# EAGLE design Rs485hub (EAGLE 6.5.0)
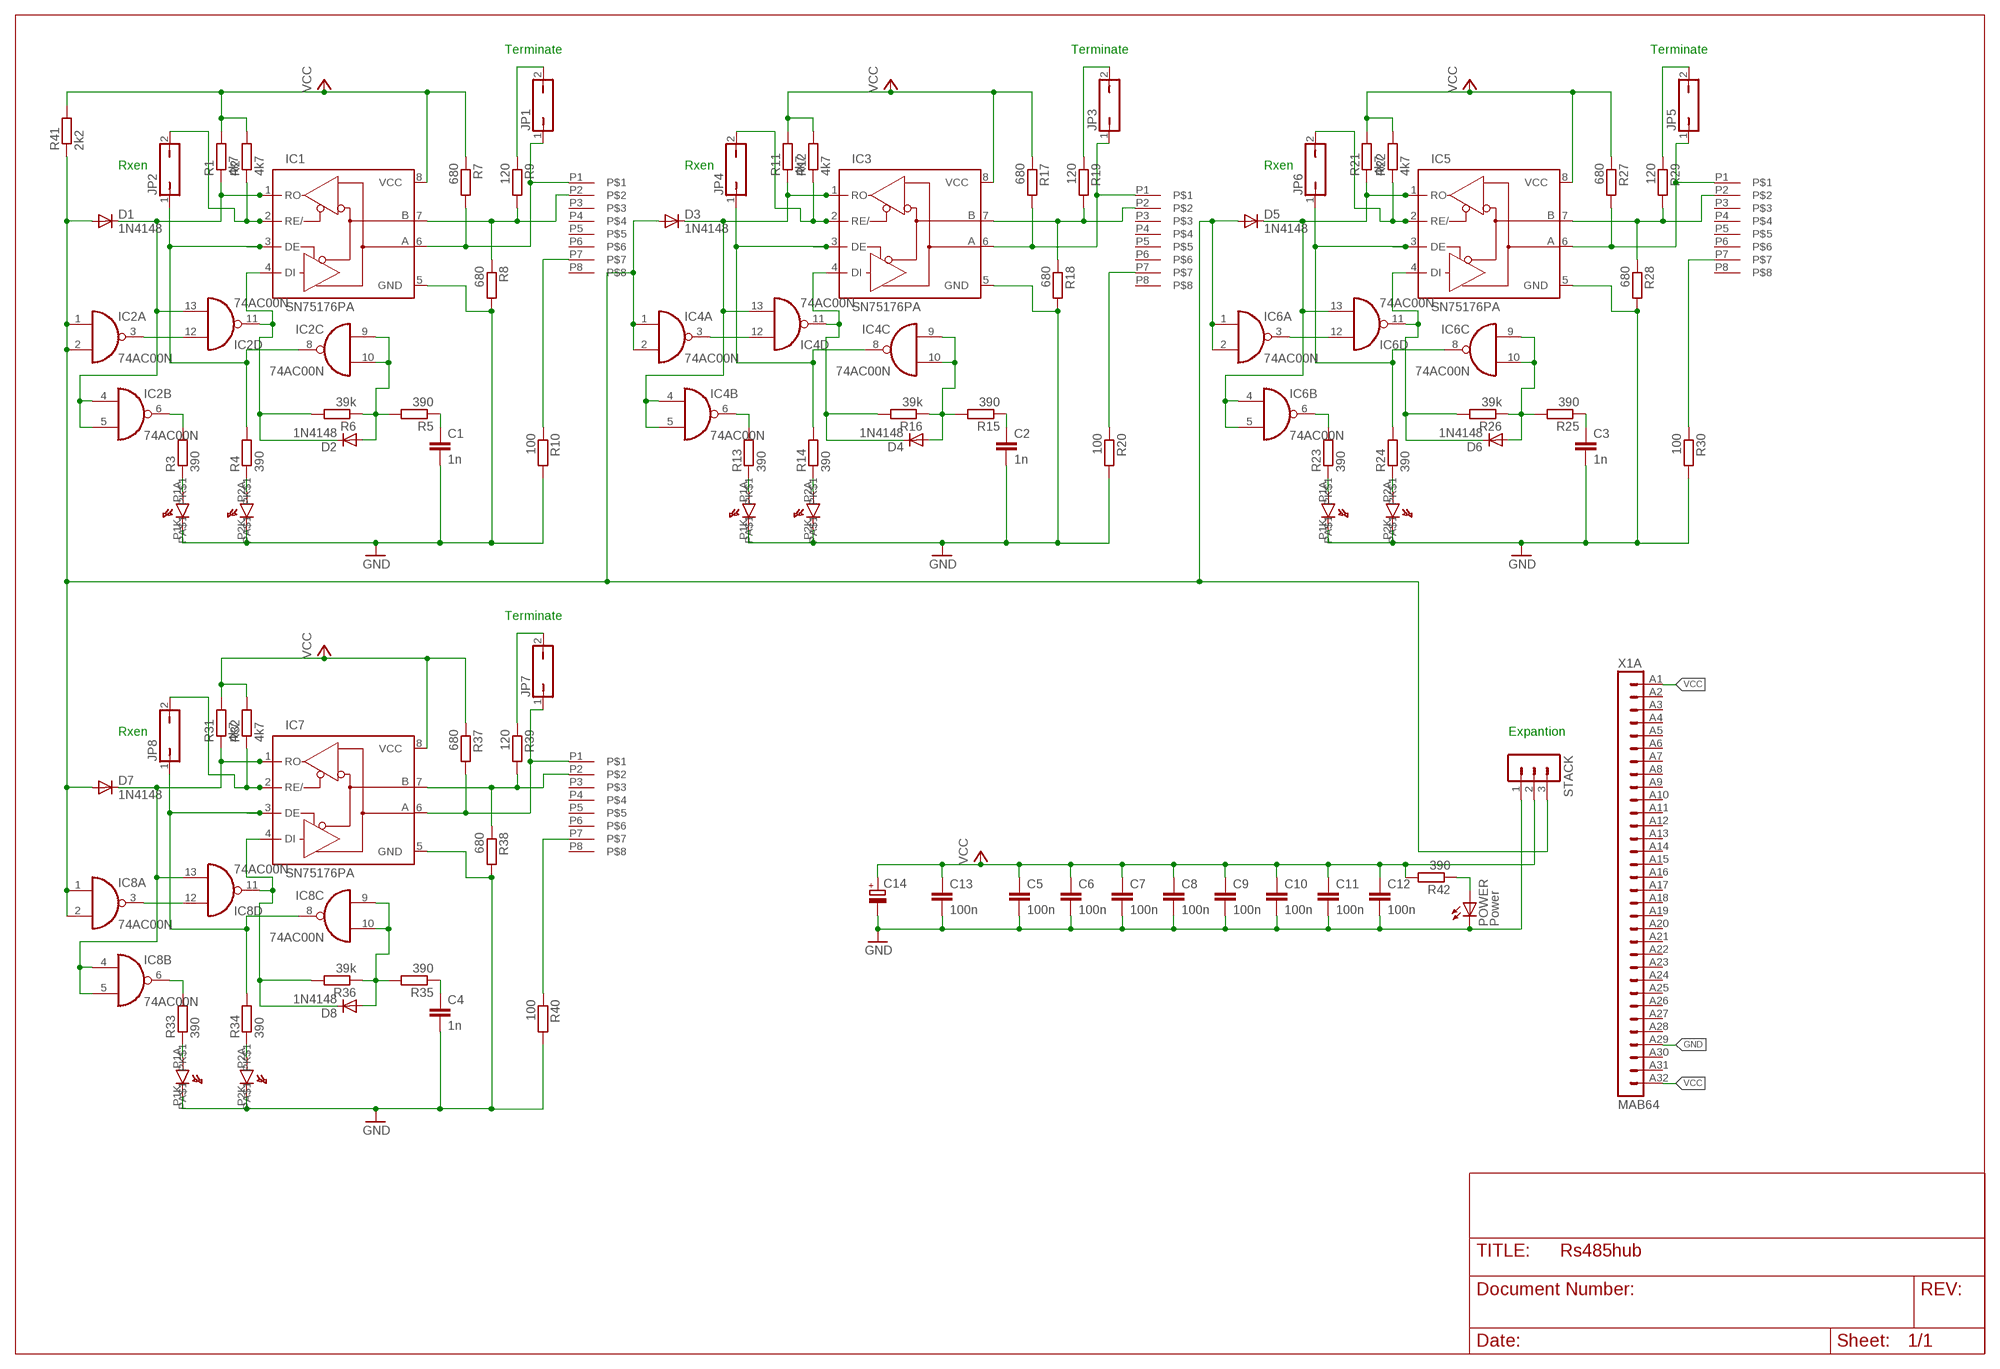
[diagram p0: schematic, sheet 1]

## Parts
C1  1n  C2,5-3  [C2.5-3]
C2  1n  C2,5-3  [C2.5-3]
C3  1n  C2,5-3  [C2.5-3]
C4  1n  C2,5-3  [C2.5-3]
C5  100n  C2,5-3  [C2.5-3]
C6  100n  C2,5-3  [C2.5-3]
C7  100n  C2,5-3  [C2.5-3]
C8  100n  C2,5-3  [C2.5-3]
C9  100n  C2,5-3  [C2.5-3]
C10  100n  C2,5-3  [C2.5-3]
C11  100n  C2,5-3  [C2.5-3]
C12  100n  C2,5-3  [C2.5-3]
C13  100n  C2,5-3  [C2.5-3]
C14  CPOL-EUE5-8.5  [E5-8,5]
D1  1N4148  [DO35-10]
D2  1N4148  [DO35-10]
D3  1N4148  [DO35-10]
D4  1N4148  [DO35-10]
D5  1N4148  [DO35-10]
D6  1N4148  [DO35-10]
D7  1N4148  [DO35-10]
D8  1N4148  [DO35-10]
IC1  SN75176PA  [DIL08]
IC2  74AC00N  [DIL14]
IC3  SN75176PA  [DIL08]
IC4  74AC00N  [DIL14]
IC5  SN75176PA  [DIL08]
IC6  74AC00N  [DIL14]
IC7  SN75176PA  [DIL08]
IC8  74AC00N  [DIL14]
JP1  JP1Q  [JP1]
JP2  JP1Q  [JP1]
JP3  JP1Q  [JP1]
JP4  JP1Q  [JP1]
JP5  JP1Q  [JP1]
JP6  JP1Q  [JP1]
JP7  JP1Q  [JP1]
JP8  JP1Q  [JP1]
POWER  Power  LED3MM  [LED3MM]
R1  4k7  R-EU_0309/10  [0309/10]
R2  4k7  R-EU_0309/10  [0309/10]
R3  390  R-EU_0309/10  [0309/10]
R4  390  R-EU_0309/10  [0309/10]
R5  390  R-EU_0309/10  [0309/10]
R6  39k  R-EU_0309/10  [0309/10]
R7  680  R-EU_0309/10  [0309/10]
R8  680  R-EU_0309/10  [0309/10]
R9  120  R-EU_0309/10  [0309/10]
R10  100  R-EU_0309/10  [0309/10]
R11  4k7  R-EU_0309/10  [0309/10]
R12  4k7  R-EU_0309/10  [0309/10]
R13  390  R-EU_0309/10  [0309/10]
R14  390  R-EU_0309/10  [0309/10]
R15  390  R-EU_0309/10  [0309/10]
R16  39k  R-EU_0309/10  [0309/10]
R17  680  R-EU_0309/10  [0309/10]
R18  680  R-EU_0309/10  [0309/10]
R19  120  R-EU_0309/10  [0309/10]
R20  100  R-EU_0309/10  [0309/10]
R21  4k7  R-EU_0309/10  [0309/10]
R22  4k7  R-EU_0309/10  [0309/10]
R23  390  R-EU_0309/10  [0309/10]
R24  390  R-EU_0309/10  [0309/10]
R25  390  R-EU_0309/10  [0309/10]
R26  39k  R-EU_0309/10  [0309/10]
R27  680  R-EU_0309/10  [0309/10]
R28  680  R-EU_0309/10  [0309/10]
R29  120  R-EU_0309/10  [0309/10]
R30  100  R-EU_0309/10  [0309/10]
R31  4k7  R-EU_0309/10  [0309/10]
R32  4k7  R-EU_0309/10  [0309/10]
R33  390  R-EU_0309/10  [0309/10]
R34  390  R-EU_0309/10  [0309/10]
R35  390  R-EU_0309/10  [0309/10]
R36  39k  R-EU_0309/10  [0309/10]
R37  680  R-EU_0309/10  [0309/10]
R38  680  R-EU_0309/10  [0309/10]
R39  120  R-EU_0309/10  [0309/10]
R40  100  R-EU_0309/10  [0309/10]
R41  2k2  R-EU_0309/10  [0309/10]
R42  390  R-EU_0309/10  [0309/10]
STACK  MA03-1  [MA03-1]
U$2  RJHS508  [P-RJHS-538X]
U$3  RJHS508  [P-RJHS-538X]
U$4  RJHS508  [P-RJHS-538X]
U$5  RJHS508  [P-RJHS-538X]
X1  MAB64  [MAB64]

## Nets
DATABUS: D1.A D3.A D5.A D7.A IC2.1(A:I0) IC2.2(A:I1) IC4.1(A:I0) IC4.2(A:I1) IC6.1(A:I0) IC6.2(A:I1) IC8.1(A:I0) IC8.2(A:I1) R41.1 STACK.3
GND [Gnd]: C1.2 C2.2 C3.2 C4.2 C5.2 C6.2 C7.2 C8.2 C9.2 C10.2 C11.2 C12.2 C13.2 C14.- IC1.5(GND) IC3.5(GND) IC5.5(GND) IC7.5(GND) POWER.K(C) R8.2 R10.2 R18.2 R20.2 R28.2 R30.2 R38.2 R40.2 STACK.1 U$2.P1K(PK$1) U$2.P2K(PK$1) U$3.P1K(PK$1) U$3.P2K(PK$1) U$4.P1K(PK$1) U$4.P2K(PK$1) U$5.P1K(PK$1) U$5.P2K(PK$1) X1.A29
N$1: R4.1 U$2.P2A(PA$1)
N$2: R3.1 U$2.P1A(PA$1)
N$3: R10.1 U$2.P7
N$4: IC1.7(B) R8.1 R9.2 U$2.P2
N$5: JP1.2 R9.1
N$6: R14.1 U$3.P2A(PA$1)
N$8: D1.C IC1.1(RO) IC2.4(B:I0) IC2.5(B:I1) IC2.13(D:I1) R1.1
N$9: IC2.3(A:O) IC2.12(D:I0)
N$10: IC1.6(A) JP1.1 R7.2 U$2.P1
N$11: IC2.6(B:O) R3.2
N$12: IC1.3(DE) IC2.8(C:O) JP2.1 R4.2
N$13: IC1.2(RE/) JP2.2 R2.1
N$14: D2.A IC2.9(C:I0) IC2.10(C:I1) R5.2 R6.1
N$15: D2.C IC1.4(DI) IC2.11(D:O) R6.2
N$16: C1.1 R5.1
N$17: R13.1 U$3.P1A(PA$1)
N$18: IC3.7(B) R18.1 R19.2 U$3.P2
N$19: JP3.2 R19.1
N$20: IC3.6(A) JP3.1 R17.2 U$3.P1
N$21: IC7.6(A) JP7.1 R37.2 U$5.P1
N$22: D3.C IC3.1(RO) IC4.4(B:I0) IC4.5(B:I1) IC4.13(D:I1) R11.1
N$23: IC4.3(A:O) IC4.12(D:I0)
N$24: IC4.6(B:O) R13.2
N$25: IC3.3(DE) IC4.8(C:O) JP4.1 R14.2
N$26: D4.A IC4.9(C:I0) IC4.10(C:I1) R15.2 R16.1
N$27: D4.C IC3.4(DI) IC4.11(D:O) R16.2
N$28: C2.1 R15.1
N$29: IC3.2(RE/) JP4.2 R12.1
N$30: R20.1 U$3.P7
N$31: R24.1 U$4.P2A(PA$1)
N$32: R23.1 U$4.P1A(PA$1)
N$33: IC5.7(B) R28.1 R29.2 U$4.P2
N$34: JP5.2 R29.1
N$35: IC5.6(A) JP5.1 R27.2 U$4.P1
N$36: POWER.A R42.1
N$37: D5.C IC5.1(RO) IC6.4(B:I0) IC6.5(B:I1) IC6.13(D:I1) R21.1
N$38: IC6.3(A:O) IC6.12(D:I0)
N$39: IC6.6(B:O) R23.2
N$40: IC5.3(DE) IC6.8(C:O) JP6.1 R24.2
N$41: D6.A IC6.9(C:I0) IC6.10(C:I1) R25.2 R26.1
N$42: D6.C IC5.4(DI) IC6.11(D:O) R26.2
N$43: C3.1 R25.1
N$44: IC5.2(RE/) JP6.2 R22.1
N$45: R30.1 U$4.P7
N$46: R34.1 U$5.P2A(PA$1)
N$47: R33.1 U$5.P1A(PA$1)
N$48: IC7.7(B) R38.1 R39.2 U$5.P2
N$49: JP7.2 R39.1
N$52: D7.C IC7.1(RO) IC8.4(B:I0) IC8.5(B:I1) IC8.13(D:I1) R31.1
N$53: IC8.3(A:O) IC8.12(D:I0)
N$54: IC8.6(B:O) R33.2
N$55: IC7.3(DE) IC8.8(C:O) JP8.1 R34.2
N$56: D8.A IC8.9(C:I0) IC8.10(C:I1) R35.2 R36.1
N$57: D8.C IC7.4(DI) IC8.11(D:O) R36.2
N$58: C4.1 R35.1
N$59: IC7.2(RE/) JP8.2 R32.1
N$60: R40.1 U$5.P7
VCC [Vcc]: C5.1 C6.1 C7.1 C8.1 C9.1 C10.1 C11.1 C12.1 C13.1 C14.+ IC1.8(VCC) IC3.8(VCC) IC5.8(VCC) IC7.8(VCC) R1.2 R2.2 R7.1 R11.2 R12.2 R17.1 R21.2 R22.2 R27.1 R31.2 R32.2 R37.1 R41.2 R42.2 STACK.2 X1.A1 X1.A32
Unconnected: U$2.P3 U$2.P4 U$2.P5 U$2.P6 U$2.P8 U$3.P3 U$3.P4 U$3.P5 U$3.P6 U$3.P8 U$4.P3 U$4.P4 U$4.P5 U$4.P6 U$4.P8 U$5.P3 U$5.P4 U$5.P5 U$5.P6 U$5.P8 X1.A2 X1.A3 X1.A4 X1.A5 X1.A6 X1.A7 X1.A8 X1.A9 X1.A10 X1.A11 X1.A12 X1.A13 X1.A14 X1.A15 X1.A16 X1.A17 X1.A18 X1.A19 X1.A20 X1.A21 X1.A22 X1.A23 X1.A24 X1.A25 X1.A26 X1.A27 X1.A28 X1.A30 X1.A31 X1.B1 X1.B2 X1.B3 X1.B4 X1.B5 X1.B6 X1.B7 X1.B8 X1.B9 X1.B10 X1.B11 X1.B12 X1.B13 X1.B14 X1.B15 X1.B16 X1.B17 X1.B18 X1.B19 X1.B20 X1.B21 X1.B22 X1.B23 X1.B24 X1.B25 X1.B26 X1.B27 X1.B28 X1.B29 X1.B30 X1.B31 X1.B32

## Notes on the sheet
- Terminate | Terminate | Terminate
- Rxen | Rxen | Rxen
- Terminate
- Rxen | Expantion

## Power pins joined to a net without a drawn wire
GND: IC2.7(P:GND) IC4.7(P:GND) IC6.7(P:GND) IC8.7(P:GND)
VCC: IC2.14(P:VCC) IC4.14(P:VCC) IC6.14(P:VCC) IC8.14(P:VCC)

## Library data of the parts
C1-C13 = capacitor-wima:C: CAPACITOR naming: grid - package width
C14 = rcl:CPOL-EU: POLARIZED CAPACITOR, European symbol
D1-D8 = diode:1N4148: DIODE high speed (Philips)
IC1 IC3 IC5 IC7 = Evert:SN75176: +5V, Fail-Safe, 40Mbps, Profibus RS-485/RS-422 Transceivers
IC2 IC4 IC6 IC8 = 74xx-eu:74*00: Quad 2-input NAND gate
JP1-JP8 = jumper:JP1Q: JUMPER
POWER = led:LED: LED OSRAM: - CHIPLED LG R971, LG N971, LY N971, LG Q971, LY Q971, LO R971, LY R971 LH N974, LH R974 LS Q976, LO Q976, LY Q976 LO Q996 - Hyper CHIPLED LW Q18S LB Q993, LB Q99A, LB R99A - SideLED LS A670, LO A670, LY A670, LG A670, LP A670 LB A673, LV A673, LT A673, LW A673 LH A674 LY A675 LS A676, LA A676, LO A676, LY A676, LW A676 LS A679, LY A679, LG A679 - Hyper Micro SIDELED® LS Y876, LA Y876, LO Y876, LY Y876 LT Y87S - SmartLED LW L88C, LW L88S LB L89C, LB L89S, LG L890 LS L89K, LO L89K, LY L89K LS L896, LA L896, LO L896, LY L896 - TOPLED LS T670, LO T670, LY T670, LG T670, LP T670 LSG T670, LSP T670, LSY T670, LOP T670, LYG T670 LG T671, LOG T671, LSG T671 LB T673, LV T673, LT T673, LW T673 LH T674 LS T676, LA T676, LO T676, LY T676, LB T676, LH T676, LSB T676, LW T676 LB T67C, LV T67C, LT T67C, LS T67K, LO T67K, LY T67K, LW E67C LS E67B, LA E67B, LO E67B, LY E67B, LB E67C, LV E67C, LT E67C LW T67C LS T679, LY T679, LG T679 LS T770, LO T770, LY T770, LG T770, LP T770 LB T773, LV T773, LT T773, LW T773 LH T774 LS E675, LA E675, LY E675, LS T675 LS T776, LA T776, LO T776, LY T776, LB T776 LHGB T686 LT T68C, LB T68C - Hyper Mini TOPLED® LB M676 - Mini TOPLED Santana® LG M470 LS M47K, LO M47K, LY M47K Source: http://www.osram.convergy.de LUXEON: - LUMILED® LXK2-PW12-R00, LXK2-PW12-S00, LXK2-PW14-U00, LXK2-PW14-V00 LXK2-PM12-R00, LXK2-PM12-S00, LXK2-PM14-U00 LXK2-PE12-Q00, LXK2-PE12-R00, LXK2-PE12-S00, LXK2-PE14-T00, LXK2-PE14-U00 LXK2-PB12-K00, LXK2-PB12-L00, LXK2-PB12-M00, LXK2-PB14-N00, LXK2-PB14-P00, LXK2-PB14-Q00 LXK2-PR12-L00, LXK2-PR12-M00, LXK2-PR14-Q00, LXK2-PR14-R00 LXK2-PD12-Q00, LXK2-PD12-R00, LXK2-PD12-S00 LXK2-PH12-R00, LXK2-PH12-S00 LXK2-PL12-P00, LXK2-PL12-Q00, LXK2-PL12-R00 Source: www.luxeon.com KINGBRIGHT: KA-3528ASYC Source: www.kingbright.com
R1-R42 = rcl:R-EU_: RESISTOR, European symbol
STACK = con-lstb:MA03-1: PIN HEADER
U$2-U$5 = RJHS:RJHS508
X1 = con-vg:MAB64: CONNECTOR male, 94 pins, type B, rows AB, grid 2.54 mm

## Net classes
0 default: width 0.4 mm, clearance 0.254 mm
1 Vcc: width 1 mm, clearance 0.15 mm
2 Gnd: clearance 0.15 mm

## Board
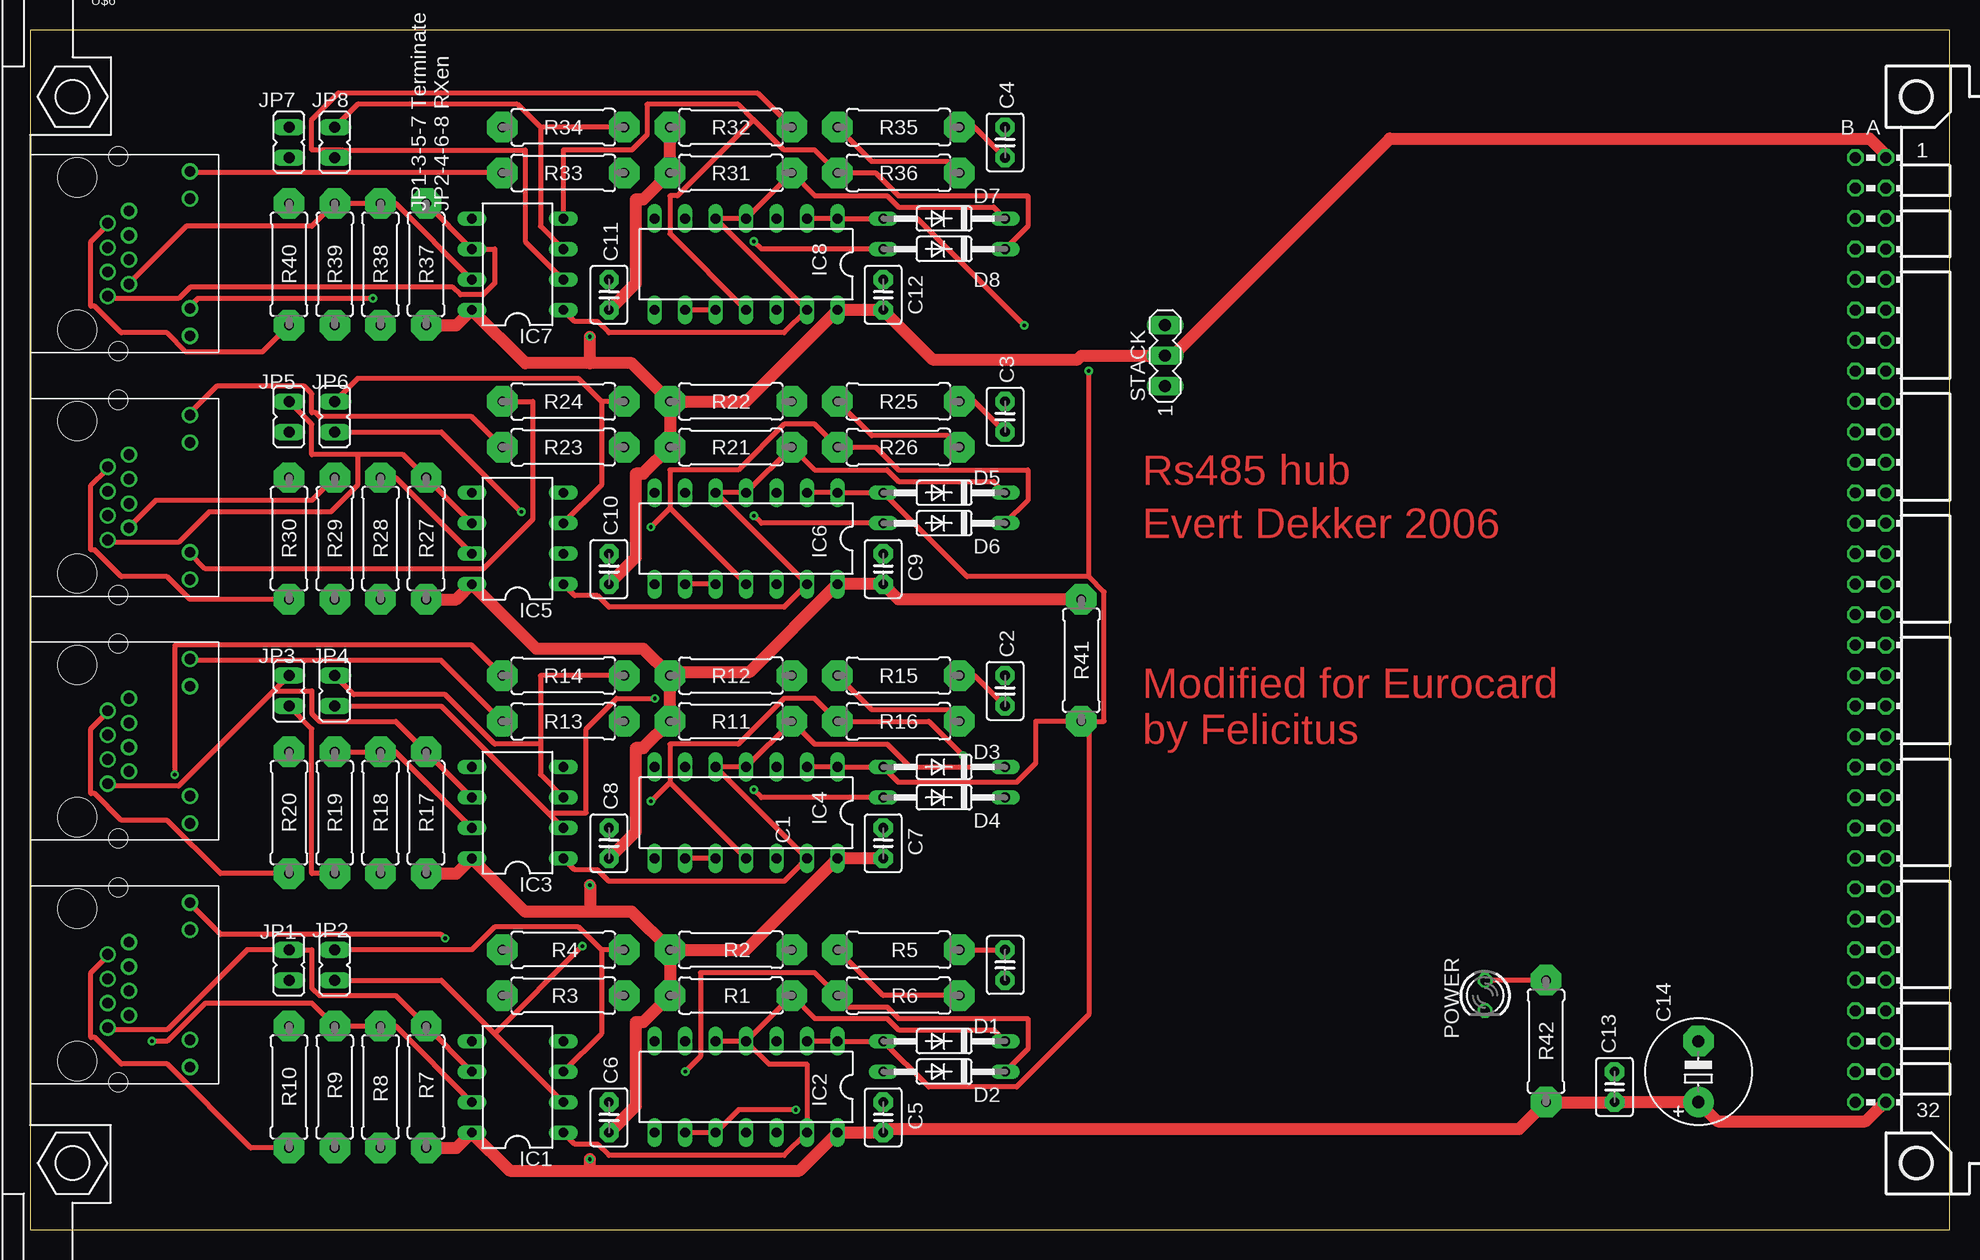
[diagram p1: board, top side]
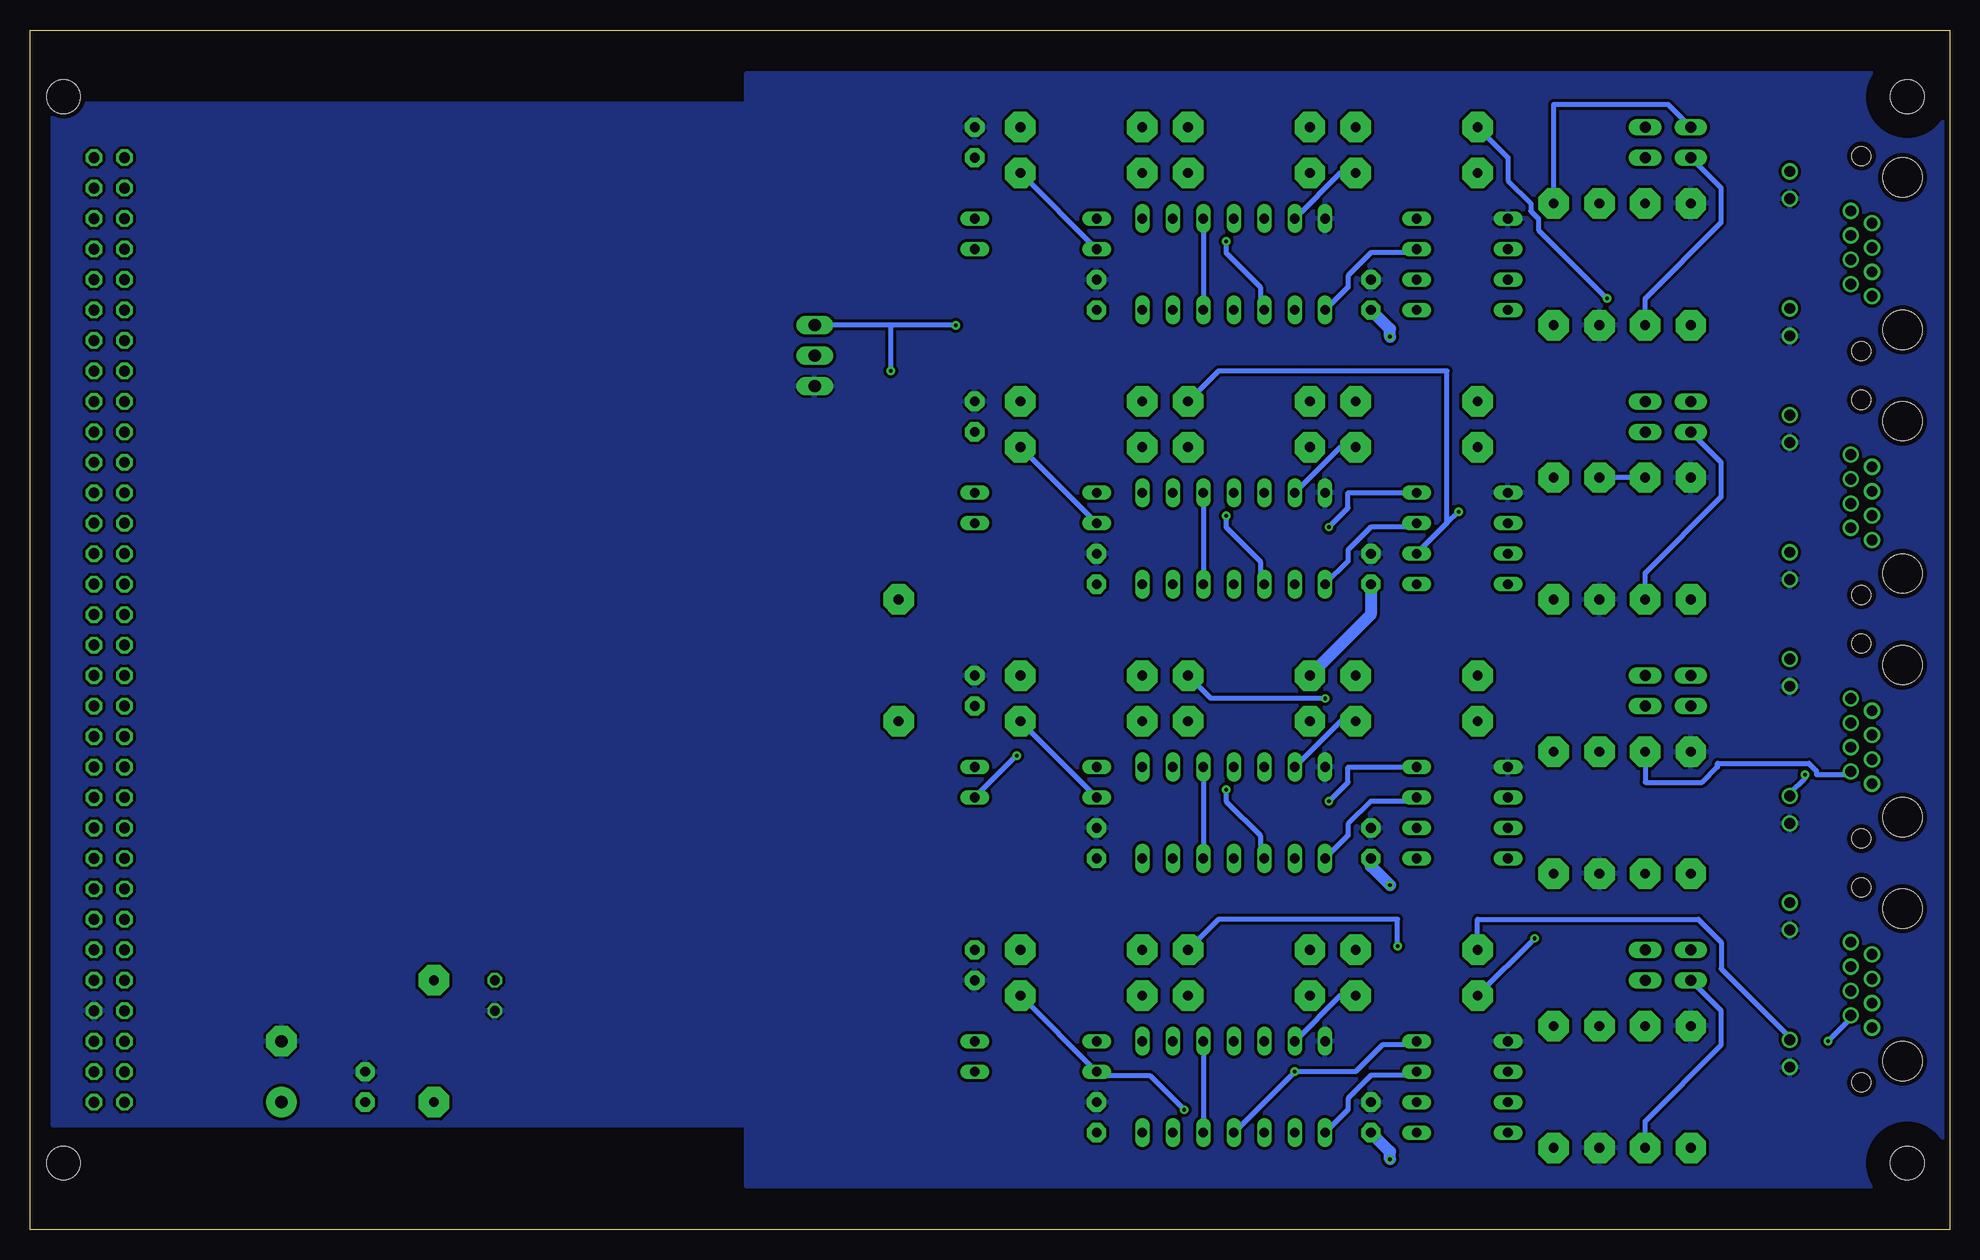
[diagram p2: board, bottom side, seen from below]

Size 160.03 x 100.03 mm. Coordinates in mm from the lower left corner, seen from the top.
Copper layers (1*16): Top 0.035mm / dielectric 1.5mm / Bottom 0.035mm
Design rules "pcb-devboards_35µmCU_200µm_Strukturen_Abstaende": minimum track width 0.2mm, minimum drill 0.3mm, track to track 0.2mm, track to pad 0.2mm, pad to pad 0.2mm, via to via 0.2mm, smd to smd 0.2mm, copper to edge 0.4mm, drill to drill 0.4mm, minimum pad ring 0.2mm, minimum via ring 0.2mm, stop-mask expansion 0.1mm, vias tented up to drill 0mil, thermal gap 0.2mm

### Footprints (pad centres in the part's own frame; a part is rotated, then mirrored left to right if it is on the bottom)
C2.5-3 = drill 0.813 pad 1.6 octagon: 1 -1.27,0; 2 1.27,0
E5-8,5 = drill 1.016 pad 2.54: + -2.54,0 | drill 1.016 pad 2.54 octagon: - 2.54,0
DO35-10 = drill 0.813 long: A 5.08,0; C -5.08,0
DIL08 = drill 0.813 long: 1 -3.81,-3.81; 2 -1.27,-3.81; 3 1.27,-3.81; 4 3.81,-3.81; 5 3.81,3.81; 6 1.27,3.81; 7 -1.27,3.81; 8 -3.81,3.81
DIL14 = drill 0.813 long: 1 -7.62,-3.81; 2 -5.08,-3.81; 3 -2.54,-3.81; 4 0,-3.81; 5 2.54,-3.81; 6 5.08,-3.81; 7 7.62,-3.81; 8 7.62,3.81; 9 5.08,3.81; 10 2.54,3.81; 11 0,3.81; 12 -2.54,3.81; 13 -5.08,3.81; 14 -7.62,3.81
JP1 = drill 0.914 long: 1 0,-1.27; 2 0,1.27
LED3MM = drill 0.813 octagon: A -1.27,0; K 1.27,0
0309/10 = drill 0.813 pad 2.54 octagon: 1 -5.08,0; 2 5.08,0
MA03-1 = drill 1.016 long: 1 -2.54,0; 2 0,0; 3 2.54,0
P-RJHS-538X = drill 0.9: P1 7.112,-1.778; P1A -3.302,5.08; P1K -1.016,5.08; P2 6.096,0; P2A 8.128,5.08; P2K 10.414,5.08; P3 5.08,-1.778; P4 4.064,0; P5 3.048,-1.778; P6 2.032,0; P7 1.016,-1.778; P8 0,0 | hole 3.251: 9.906,-4.318; -2.794,-4.318 | hole 1.575: -4.572,-0.889; 11.684,-0.889
EK-FP = hole 2.794: 3.556,44.45; 3.556,-44.45
MAB64 = drill 0.914 octagon: A1 -2.54,39.37; A2 -2.54,36.83; A3 -2.54,34.29; A4 -2.54,31.75; A5 -2.54,29.21; A6 -2.54,26.67; A7 -2.54,24.13; A8 -2.54,21.59; A9 -2.54,19.05; A10 -2.54,16.51; A11 -2.54,13.97; A12 -2.54,11.43; A13 -2.54,8.89; A14 -2.54,6.35; A15 -2.54,3.81; A16 -2.54,1.27; A17 -2.54,-1.27; A18 -2.54,-3.81; A19 -2.54,-6.35; A20 -2.54,-8.89; A21 -2.54,-11.43; A22 -2.54,-13.97; A23 -2.54,-16.51; A24 -2.54,-19.05; A25 -2.54,-21.59; A26 -2.54,-24.13; A27 -2.54,-26.67; A28 -2.54,-29.21; A29 -2.54,-31.75; A30 -2.54,-34.29; A31 -2.54,-36.83; A32 -2.54,-39.37; B1 -5.08,39.37; B2 -5.08,36.83; B3 -5.08,34.29; B4 -5.08,31.75; B5 -5.08,29.21; B6 -5.08,26.67; B7 -5.08,24.13; B8 -5.08,21.59; B9 -5.08,19.05; B10 -5.08,16.51; B11 -5.08,13.97; B12 -5.08,11.43; B13 -5.08,8.89; B14 -5.08,6.35; B15 -5.08,3.81; B16 -5.08,1.27; B17 -5.08,-1.27; B18 -5.08,-3.81; B19 -5.08,-6.35; B20 -5.08,-8.89; B21 -5.08,-11.43; B22 -5.08,-13.97; B23 -5.08,-16.51; B24 -5.08,-19.05; B25 -5.08,-21.59; B26 -5.08,-24.13; B27 -5.08,-26.67; B28 -5.08,-29.21; B29 -5.08,-31.75; B30 -5.08,-34.29; B31 -5.08,-36.83; B32 -5.08,-39.37 | hole 2.794: 0,44.45; 0,-44.45

### Placement (x,y rotation side)
C1  81.28,22.07 270 top
C2  81.28,44.93 90 top
C3  81.28,67.79 90 top
C4  81.28,90.65 90 top
C5  71.12,9.37 90 top
C6  48.26,9.37 90 top
C7  71.12,32.23 90 top
C8  48.26,32.23 90 top
C9  71.12,55.09 90 top
C10  48.26,55.09 90 top
C11  48.26,77.95 90 top
C12  71.12,77.95 90 top
C13  132.08,11.91 90 top
C14  139.06,13.18 90 top
D1  76.2,15.72 180 top
D2  76.2,13.18 180 top
D3  76.2,38.58 180 top
D4  76.2,36.04 180 top
D5  76.2,61.44 180 top
D6  76.2,58.9 180 top
D7  76.2,84.3 180 top
D8  76.2,81.76 180 top
IC1  40.64,11.91 90 top
IC2  59.69,11.91 180 top
IC3  40.64,34.77 90 top
IC4  59.69,34.77 180 top
IC5  40.64,57.63 90 top
IC6  59.69,57.63 180 top
IC7  40.64,80.49 90 top
IC8  59.69,80.49 180 top
JP1  21.59,22.07 180 top
JP2  25.4,22.07 180 top
JP3  21.59,44.93 180 top
JP4  25.4,44.93 180 top
JP5  21.59,67.79 180 top
JP6  25.4,67.79 180 top
JP7  21.59,90.65 180 top
JP8  25.4,90.65 180 top
POWER  121.28,19.53 270 top
R1  58.42,19.53 180 top
R2  58.42,23.34 180 top
R3  44.45,19.53 0 top
R4  44.45,23.34 0 top
R5  72.39,23.34 180 top
R6  72.39,19.53 180 top
R7  33.02,11.91 90 top
R8  29.21,11.91 270 top
R9  25.4,11.91 90 top
R10  21.59,11.91 90 top
R11  58.42,42.39 180 top
R12  58.42,46.2 180 top
R13  44.45,42.39 0 top
R14  44.45,46.2 0 top
R15  72.39,46.2 180 top
R16  72.39,42.39 180 top
R17  33.02,34.77 90 top
R18  29.21,34.77 270 top
R19  25.4,34.77 90 top
R20  21.59,34.77 90 top
R21  58.42,65.25 180 top
R22  58.42,69.06 180 top
R23  44.45,65.25 0 top
R24  44.45,69.06 0 top
R25  72.39,69.06 180 top
R26  72.39,65.25 180 top
R27  33.02,57.63 90 top
R28  29.21,57.63 270 top
R29  25.4,57.63 90 top
R30  21.59,57.63 90 top
R31  58.42,88.11 180 top
R32  58.42,91.92 180 top
R33  44.45,88.11 0 top
R34  44.45,91.92 0 top
R35  72.39,91.92 180 top
R36  72.39,88.11 180 top
R37  33.02,80.49 90 top
R38  29.21,80.49 270 top
R39  25.4,80.49 90 top
R40  21.59,80.49 90 top
R41  87.63,47.47 90 top
R42  126.37,15.72 270 top
STACK  94.62,72.87 90 top
U$2  8.26,23.98 270 top
U$3  8.26,44.3 270 top
U$4  8.26,64.62 270 top
U$5  8.26,84.94 270 top
U$6  [EK-FP]  0,50.01 0 top
X1  157.23,50.01 0 top

### Tracks (layer width: path | path; a pad name or v marks a point on that pad's centre or on a via)
DATABUS  (via drill 0.3)
  Top 0.4: IC8.2 IC8.1 D7.A 73.98,84.3 v82.87,75.41 | IC6.2 IC6.1 D5.A 78.11,54.46 88.27,54.46 | IC4.2 IC4.1 D3.A 72.39,37.31 82.23,37.31 83.82,38.9 83.82,42.39 R41.1 88.27,42.39 | IC2.2 IC2.1 D1.A 74.93,11.91 82.23,11.91 88.27,17.95 88.27,42.39 | 88.27,54.46 89.53,53.19 89.53,42.39 88.27,42.39 | 88.27,54.46 v88.27,71.6
  Bottom 0.4: v82.87,75.41 88.27,75.41 | 88.27,75.41 STACK.3 | v88.27,71.6 88.27,75.41
GND
  pour Bottom (isolate 0.254): 0.63,3.66 0.63,96.37 100.33,96.37 100.33,93.83 158.12,93.83 158.12,8.74 100.33,8.74 100.33,3.66
N$1
  Bottom 0.4: R4.1 39.37,25.88 20.96,25.88 19.05,23.98 19.05,21.76 13.33,16.04 U$2.P2A
N$2  (via drill 0.3)
  Top 0.4: v34.61,24.29 34.29,24.61 15.88,24.61 13.33,27.15 U$2.P1A
  Bottom 0.4: R3.1 v34.61,24.29
N$3
  Top 0.4: R10.1 18.41,6.83 11.43,13.82 7.62,13.82 5.4,16.04 5.08,16.04 5.08,21.44 6.35,22.71 U$2.P7
N$4  (via drill 0.3)
  Top 0.4: IC1.7 30.48,16.99 R8.1 R9.2 23.5,18.9 14.61,18.9 11.43,15.72 v10.16,15.72
  Bottom 0.4: v10.16,15.72 8.26,17.63 U$2.P2
N$5
  Bottom 0.4: JP1.2 19.05,18.26 19.05,15.4 25.4,9.06 R9.1
N$6  (via drill 0.3)
  Top 0.4: v12.06,37.95 12.06,48.74 36.83,48.74 R14.1
  Bottom 0.4: v12.06,37.95 12.06,37.63 13.33,36.36 U$3.P2A
N$8
  Top 0.4: IC1.1 45.4,7.15 47.31,7.15 48.26,6.2 62.87,6.2 IC2.13 64.77,13.82 61.59,13.82 IC2.4 | IC2.4 IC2.5 | D1.C 80.33,16.68 72.39,16.68 71.44,17.63 65.41,17.63 R1.1 IC2.4
N$9
  Bottom 0.4: IC2.3 IC2.12
N$10
  Top 0.4: IC1.6 R7.2 30.48,19.53 24.13,19.53 23.5,20.17 23.5,23.34 JP1.1 18.1,23.34 11.43,16.68 6.67,16.68 U$2.P1
N$11
  Bottom 0.4: IC2.6 50.8,19.53 R3.2
N$12
  Top 0.4: IC1.3 47.62,16.36 47.62,23.34 | R4.2 47.62,23.34 | JP2.1 36.83,23.34 38.73,25.25 45.72,25.25 47.62,23.34
  Bottom 0.4: IC2.8 50.16,10.01 50.16,10.96 48.26,12.87 44.45,12.87 IC1.3
N$13  (via drill 0.3)
  Top 0.4: 38.73,16.36 34.29,20.8 JP2.2 | 38.73,16.36 IC1.2 | 38.73,16.36 v46.04,23.66
  Bottom 0.4: R2.1 60.96,25.88 46.04,25.88 v46.04,23.66
N$14  (via drill 0.3)
  Top 0.4: IC2.9 IC2.10 59.06,10.01 v63.82,10.01 | R5.2 71.12,19.53 R6.1
  Bottom 0.4: R6.1 D2.A 71.12,12.87 66.67,12.87 v63.82,10.01
N$15  (via drill 0.3)
  Top 0.4: D2.C 83.19,15.09 83.19,17.63 72.39,17.63 71.44,18.58 68.26,18.58 R6.2 65.41,21.44 55.88,21.44 55.88,14.45 v54.61,13.18
  Bottom 0.4: IC2.11 v54.61,13.18 49.53,13.18 47.31,15.4 44.45,15.4 IC1.4
N$16
  Top 0.4: R5.1 C1.1
N$17
  Top 0.4: R13.1 34.29,47.47 13.33,47.47 U$3.P1A
N$18
  Top 0.4: IC3.7 30.48,39.85 R18.1 R19.2
  Bottom 0.4: R19.2 25.4,37.31 20.64,37.31 19.37,38.58 19.37,38.9 11.75,38.9 11.11,38.26 11.11,37.95 8.26,37.95 U$3.P2
N$19
  Top 0.4: JP3.2 23.5,41.76 23.5,29.69 R19.1
N$20
  Top 0.4: IC3.6 R17.2 30.48,42.39 24.13,42.39 23.5,43.03 23.5,44.93 20.32,44.93 | JP3.1 20.32,44.93 | 20.32,44.93 12.38,36.99 6.67,36.99 U$3.P1
N$21
  Top 0.4: R37.2 IC7.6 38.73,81.76 38.73,78.91 37.78,77.95 35.88,77.95 35.24,78.59 13.33,78.59 12.38,77.63 6.67,77.63 U$5.P1
  Bottom 0.4: JP7.1 23.5,93.83 33.02,93.83 R37.2
N$22
  Top 0.4: IC3.1 45.4,30.01 47.31,30.01 48.26,29.06 62.87,29.06 IC4.13 IC4.5 IC4.4 R11.1 65.41,40.49 71.44,40.49 73.34,38.58 D3.C
N$23
  Bottom 0.4: IC4.3 IC4.12
N$24
  Bottom 0.4: IC4.6 50.8,42.39 R13.2
N$25
  Top 0.4: IC3.3 42.55,37.95 42.55,40.49 | 42.55,40.49 42.55,46.2 R14.2 | JP4.1 26.99,44.62 34.61,44.62 38.73,40.49 42.55,40.49
  Bottom 0.4: IC4.8 50.16,32.87 50.16,33.82 48.26,35.73 44.45,35.73 IC3.3
N$26  (via drill 0.3)
  Top 0.4: IC4.10 IC4.9 | v60.33,36.68 60.96,36.04 D4.A | R15.2 70.17,43.35 76.52,43.35 R16.1
  Bottom 0.4: R16.1 D4.A | IC4.10 57.47,31.28 57.47,32.87 60.33,35.73 v60.33,36.68
N$27  (via drill 0.3)
  Top 0.4: 53.34,37.31 IC4.11 | 53.34,37.31 53.34,40.49 59.06,40.49 62.87,44.3 65.41,44.3 R16.2 74.93,42.39 v77.79,39.54 | 53.34,37.31 v51.75,35.73
  Bottom 0.4: IC3.4 50.16,38.58 50.16,37.31 v51.75,35.73 | v77.79,39.54 D4.C
N$28
  Top 0.4: C2.1 78.74,46.2 R15.1
N$29  (via drill 0.3)
  Top 0.4: 43.18,34.77 34.29,43.66 JP4.2 | 43.18,34.77 IC3.2 | v52.07,44.3 48.9,44.3 46.36,41.76 46.36,34.77 43.18,34.77
  Bottom 0.4: R12.1 61.59,44.3 v52.07,44.3
N$30
  Top 0.4: R20.1 15.88,29.69 11.43,34.14 7.62,34.14 5.4,36.36 5.08,36.36 5.08,41.76 6.35,43.03 U$3.P7
N$31
  Top 0.4: R24.1 41.91,69.06 41.91,59.22 37.78,55.09 14.61,55.09 13.33,56.36 U$4.P2A
N$32
  Top 0.4: R23.1 36.83,67.79 24.13,67.79 23.81,68.11 23.5,68.11 23.5,69.7 22.86,70.33 15.56,70.33 13.33,68.11 U$4.P1A
N$33
  Top 0.4: IC5.7 30.48,62.71 R28.1 | R29.2 23.5,60.81 10.48,60.81 8.26,58.59 U$4.P2
  Bottom 0.4: R29.2 R28.1
N$34
  Bottom 0.4: JP5.2 19.05,63.98 19.05,61.13 25.4,54.77 R29.1
N$35
  Top 0.4: IC5.6 R27.2 31.12,64.62 27.3,64.62 | 27.3,64.62 27.3,62.08 25.08,59.85 14.92,59.85 12.38,57.31 6.67,57.31 U$4.P1 | JP5.1 23.5,67.16 23.5,64.62 27.3,64.62
N$36
  Top 0.4: R42.1 POWER.A
N$37
  Top 0.4: IC5.1 45.4,52.87 47.31,52.87 48.26,51.92 62.87,51.92 IC6.13 IC6.5 IC6.4 R21.1 65.41,63.35 71.44,63.35 72.39,62.39 80.33,62.39 D5.C
N$38
  Bottom 0.4: IC6.3 IC6.12
N$39
  Bottom 0.4: IC6.6 50.8,65.25 R23.2
N$40
  Top 0.4: IC5.3 47.62,62.08 47.62,69.06 | R24.2 47.62,69.06 | JP6.1 27.3,70.97 45.72,70.97 47.62,69.06
  Bottom 0.4: IC6.8 50.16,55.73 50.16,56.68 48.26,58.59 44.45,58.59 IC5.3
N$41  (via drill 0.3)
  Top 0.4: IC6.10 IC6.9 | v60.33,59.54 60.96,58.9 D6.A | R25.2 70.17,66.2 76.52,66.2 R26.1
  Bottom 0.4: R26.1 D6.A | IC6.10 57.47,54.14 57.47,55.73 60.33,58.59 v60.33,59.54
N$42  (via drill 0.3)
  Top 0.4: 53.34,60.17 IC6.11 | 53.34,60.17 53.34,63.35 59.06,63.35 62.87,67.16 65.41,67.16 R26.2 70.48,65.25 72.39,63.35 83.19,63.35 83.19,60.81 D6.C | 53.34,60.17 v51.75,58.59
  Bottom 0.4: IC5.4 50.16,61.44 50.16,60.17 v51.75,58.59
N$43
  Top 0.4: C3.1 78.74,69.06 R25.1
N$44  (via drill 0.3)
  Top 0.4: v40.96,59.85 34.29,66.52 JP6.2
  Bottom 0.4: v40.96,59.85 41.91,58.9 | 41.91,58.9 IC5.2 | R22.1 60.96,71.6 41.91,71.6 41.91,58.9
N$45
  Top 0.4: R30.1 13.33,52.55 11.43,54.46 7.62,54.46 5.4,56.68 5.08,56.68 5.08,62.08 6.35,63.35 U$4.P7
N$46  (via drill 0.3)
  Top 0.4: v28.58,77.63 13.97,77.63 13.33,77 U$5.P2A
  Bottom 0.4: v28.58,77.63 34.29,83.35 34.29,84.3 34.93,84.94 34.93,85.57 36.83,87.48 36.83,89.38 R34.1
N$47
  Top 0.4: R33.1 13.33,88.11 U$5.P1A
N$48
  Top 0.4: IC7.7 30.48,85.57 R38.1 R39.2 23.5,83.67 13.02,83.67 8.26,78.91 U$5.P2
N$49
  Bottom 0.4: JP7.2 19.05,86.84 19.05,83.99 25.4,77.63 R39.1
N$52
  Top 0.4: IC7.1 45.4,75.73 47.31,75.73 48.26,74.78 62.87,74.78 IC8.13 IC8.5 IC8.4 R31.1 65.41,86.21 71.44,86.21 72.39,85.26 80.33,85.26 D7.C
N$53
  Bottom 0.4: IC8.3 IC8.12
N$54
  Bottom 0.4: IC8.6 50.8,88.11 R33.2
N$55
  Top 0.4: IC7.3 42.55,83.67 42.55,91.92 | R34.2 42.55,91.92 | JP8.1 27.3,93.83 40.64,93.83 42.55,91.92
  Bottom 0.4: IC8.8 50.16,78.59 50.16,79.54 48.26,81.45 44.45,81.45 IC7.3
N$56  (via drill 0.3)
  Top 0.4: IC8.10 IC8.9 | v60.33,82.4 60.96,81.76 D8.A | R35.2 70.17,89.06 76.52,89.06 R36.1
  Bottom 0.4: R36.1 D8.A | IC8.10 57.47,77 57.47,78.59 60.33,81.45 v60.33,82.4
N$57
  Top 0.4: IC7.4 44.45,90.02 50.16,90.02 51.44,91.29 51.44,93.83 59.06,93.83 60.33,92.56 | 60.33,92.56 62.87,90.02 65.41,90.02 R36.2 70.48,88.11 72.39,86.21 83.19,86.21 83.19,83.67 D8.C | IC8.11 53.34,83.03 53.34,86.21 53.98,86.21 60.33,92.56
N$58
  Top 0.4: C4.1 78.74,91.92 R35.1
N$59
  Top 0.4: IC7.2 41.28,82.4 41.28,90.02 26.04,90.02 | R32.1 60.64,94.78 25.72,94.78 23.5,92.56 23.5,90.02 26.04,90.02 | 26.04,90.02 JP8.2
N$60
  Top 0.4: R40.1 19.37,73.19 13.02,73.19 11.43,74.78 7.62,74.78 5.4,77 5.08,77 5.08,82.4 6.35,83.67 U$5.P7
VCC  (via drill 0.3)
  Top 1: C6.1 50.48,10.32 50.48,17.31 51.12,17.31 R1.2 R2.2 | R17.1 35.56,29.69 IC3.8 41.28,26.52 46.67,26.52 | C7.1 IC4.14 59.69,23.34 R2.2 | 46.67,26.52 50.16,26.52 R2.2 | X1.A32 154.62,10.64 153.03,9.06 140.65,9.06 C14.+ C13.1 R42.2 124.14,8.42 71.44,8.42 C5.1 IC2.14 64.14,4.93 46.67,4.93 | R7.1 35.56,6.83 IC1.8 40.01,4.93 46.67,4.93 | 46.67,4.93 v46.67,5.88 | R41.2 72.39,52.55 C9.1 IC6.14 60.01,46.52 53.66,46.52 R12.2 | R27.1 35.56,52.55 IC5.8 42.23,48.43 51.12,48.43 R12.2 | C8.1 50.48,33.18 50.48,40.17 51.12,40.17 R11.2 R12.2 | X1.A1 154.62,89.7 153.35,90.97 113.35,90.97 95.25,72.87 STACK.2 87.63,72.87 87.31,72.56 75.25,72.56 C12.1 IC8.14 59.69,69.06 R22.2 | C11.1 50.48,78.91 50.48,85.89 51.12,85.89 R31.2 R32.2 | C10.1 50.48,56.05 50.48,63.03 51.12,63.03 R21.2 R22.2 | R37.1 35.56,75.41 IC7.8 41.28,72.24 46.67,72.24 | 46.67,72.24 50.16,72.24 R22.2 | 46.67,72.24 v46.67,74.46 | v46.67,28.74 46.67,26.52
  Bottom 1: C6.1 46.67,6.51 v46.67,5.88 | C11.1 46.67,75.09 v46.67,74.46 | R12.2 48.26,51.28 C10.1 | v46.67,28.74 48.26,30.33 C8.1

### Text on the board
Top: Rs485 hub | Evert Dekker 2006 | Modified for Eurocard / by Felicitus
tNames: JP1-3-5-7 Terminate | JP2-4-6-8 RXen